# Altium schematic sheet mediaV3.0.SchDoc
size A2; SheetNumber: 0; SheetTotal: 0
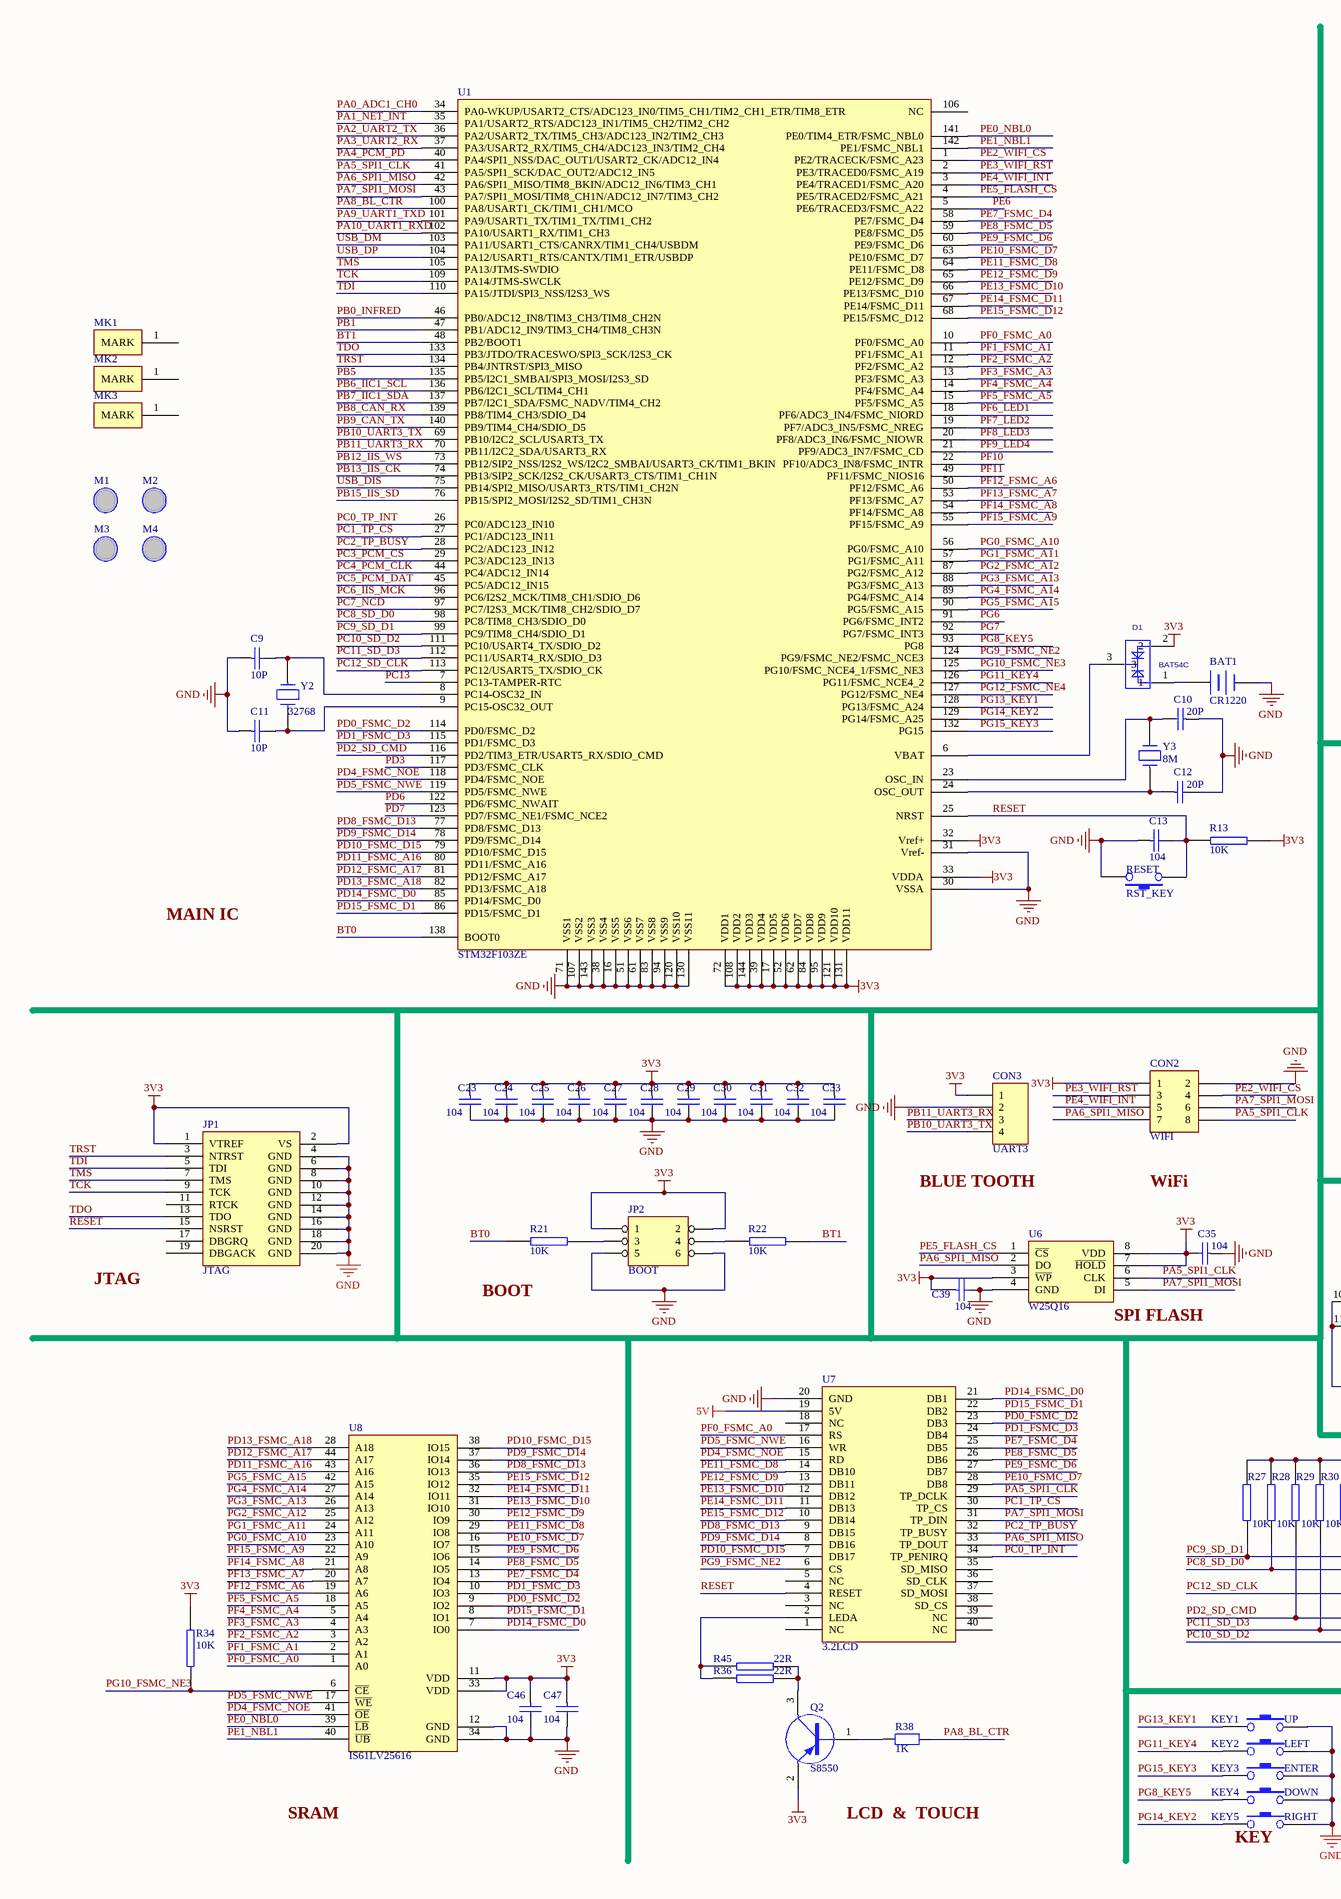
[diagram p0: mediaV3.0.SchDoc, left]
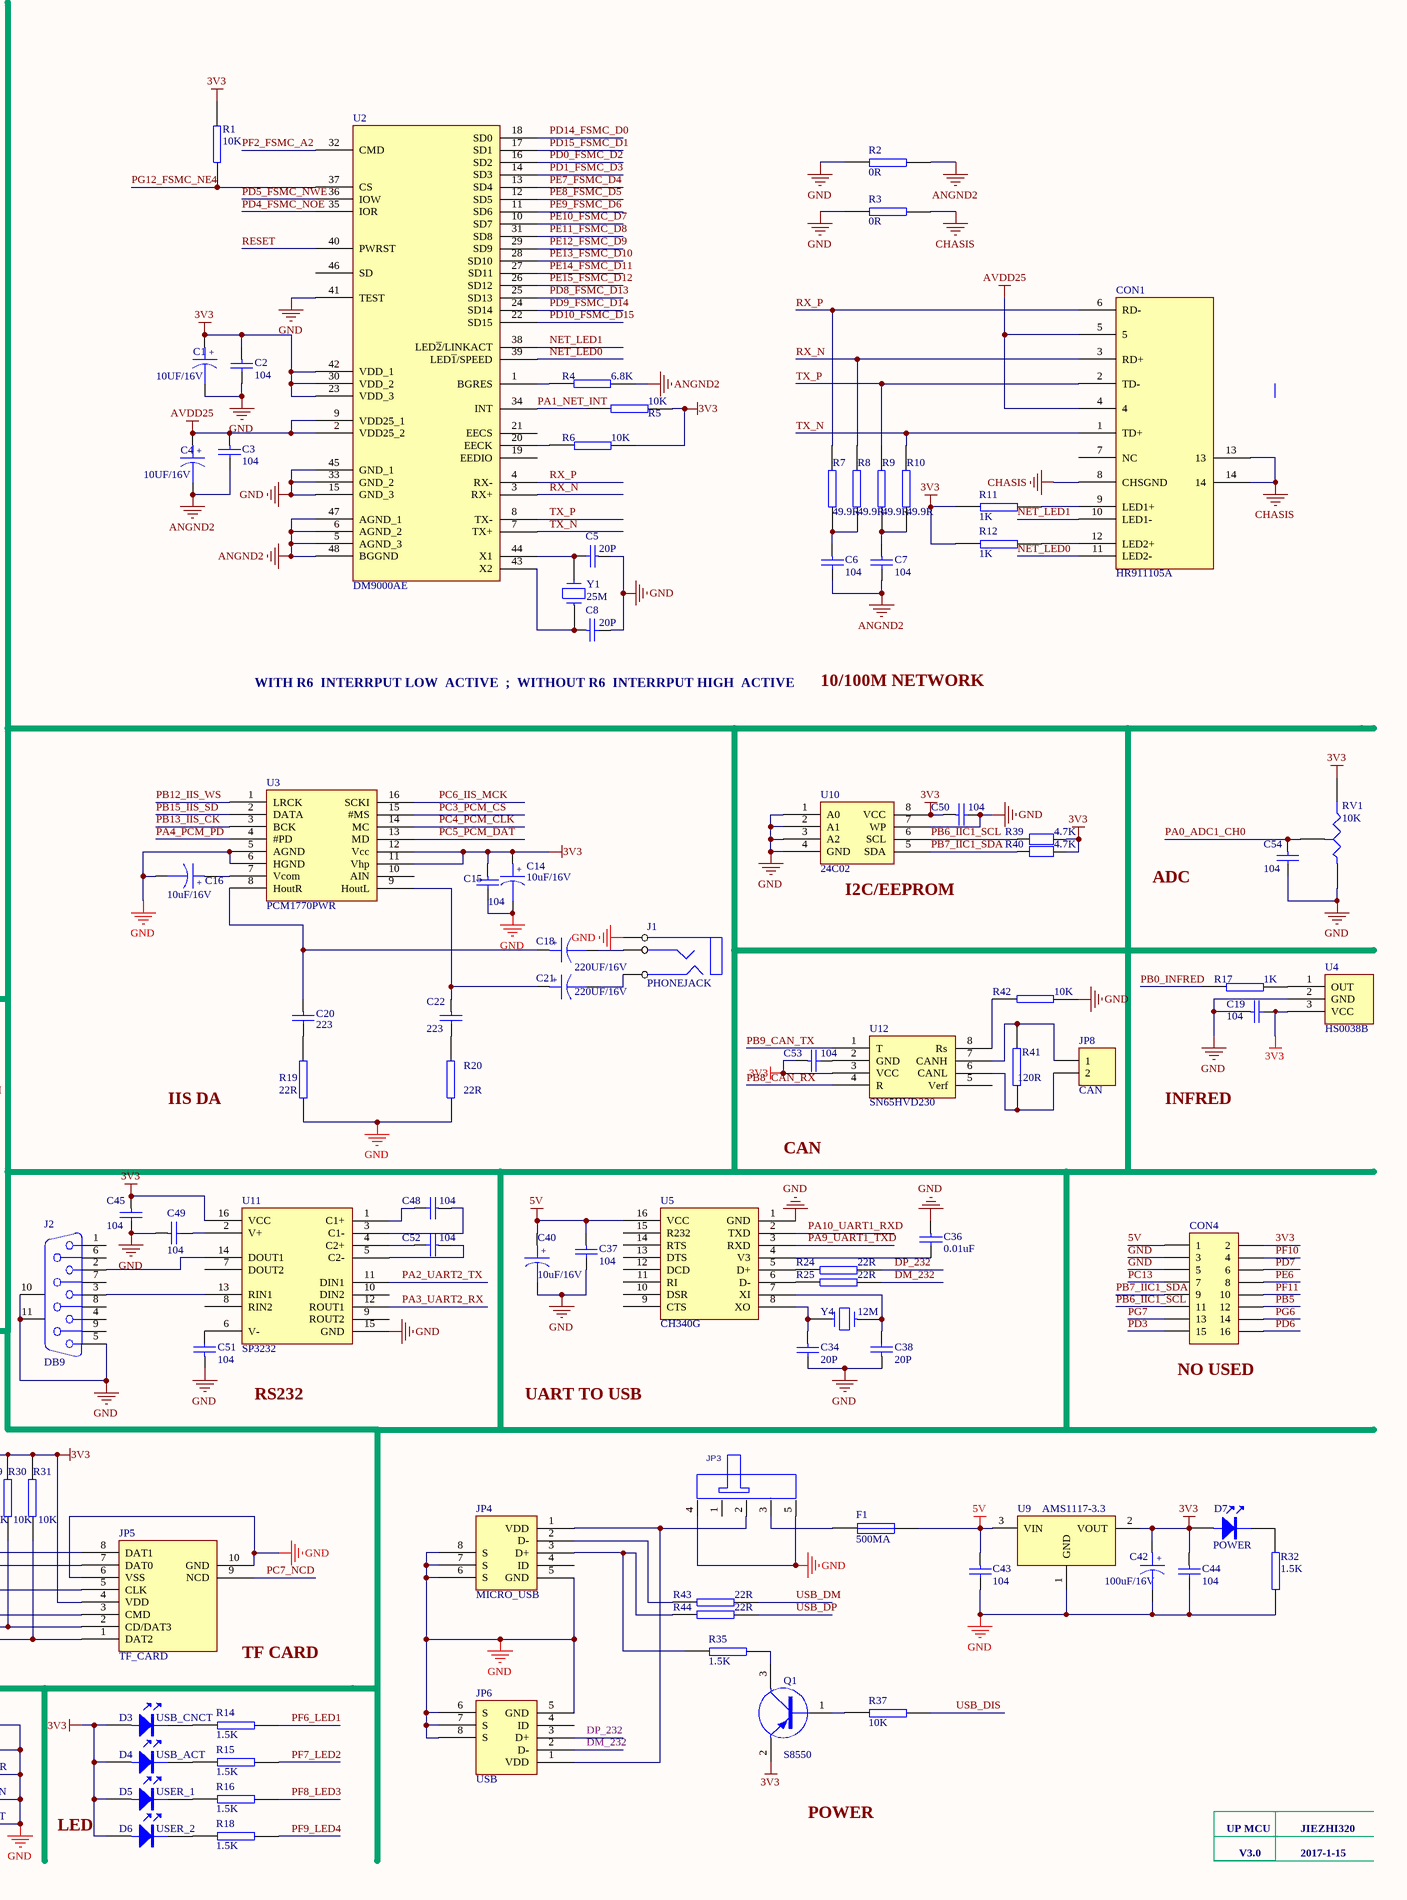
[diagram p1: mediaV3.0.SchDoc, right]

## Parts
BAT1  CR1220  [BATM-1220]
C1  10UF/16V  [0805C]
C2  104  [C0603]
C3  104  [C0603]
C4  10UF/16V  [0805C]
C5  20P  [C0603]
C6  104  [C0603]
C7  104  [C0603]
C8  20P  [C0603]
C9  10P  [C0603]
C10  20P  [C0603]
C11  10P  [C0603]
C12  20P  [C0603]
C13  104  [C0603]
C14  10uF/16V  [0805C]
C15  104  [C0603]
C16  10uF/16V  [0805C]
C18  220UF/16V  [SMD-EC-F6.3]
C19  104  [C0603]
C20  223  [C0603]
C21  220UF/16V  [SMD-EC-F6.3]
C22  223  [C0603]
C23  104  [C0603]
C24  104  [C0603]
C25  104  [C0603]
C26  104  [C0603]
C27  104  [C0603]
C28  104  [C0603]
C29  104  [C0603]
C30  104  [C0603]
C31  104  [C0603]
C32  104  [C0603]
C33  104  [C0603]
C34  20P  [C0603]
C35  104  [C0603]
C36  0.01uF  [C0603]
C37  104  [C0603]
C38  20P  [C0603]
C39  104  [C0603]
C40  10uF/16V  [0805C]
C42  100uF/16V  [SMD-EC-F6.3]
C43  104  [C0603]
C44  104  [C0603]
C45  104  [C0603]
C46  104  [C0603]
C47  104  [C0603]
C48  104  [C0603]
C49  104  [C0603]
C50  104  [C0603]
C51  104  [C0603]
C52  104  [C0603]
C53  104  [C0603]
C54  104  [C0603]
CON1  HR911105A  [CON-HR911105C/RJ45/SC-JL]
CON2  WIFI  [WIFI2*4-2.54]
CON3  UART3  [DIP4*1-2.54]
CON4  (no value)  [DIP8*2-2.54]
D1  BAT54C  [SOT-23]
D3  USB_CNCT  [D0603]
D4  USB_ACT  [D0603]
D5  USER_1  [D0603]
D6  USER_2  [D0603]
D7  POWER  [D0603]
F1  500MA  [R0805]
J1  PHONEJACK  [PHONE_ST]
J2  DB9  [DB-9/FM]
JP1  JTAG  [JTAG_20]
JP2  BOOT  [BOOT_SEL]
JP3  SW-POWER  [SW13_6]  (value not drawn)
JP4  MICRO_USB  [USB-MICRO-5P-2 - NJ]
JP5  TF_CARD  [TF-2]
JP6  USB  [USB-MICRO-5P-2 - NJ]
JP8  CAN  [CON_2PIN - N]
KEY1  UP  [KEY4 - SMD]
KEY2  LEFT  [KEY4 - SMD]
KEY3  ENTER  [KEY4 - SMD]
KEY4  DOWN  [KEY4 - SMD]
KEY5  RIGHT  [KEY4 - SMD]
M1  MM  [PAD]  (value not drawn)
M2  MM  [PAD]  (value not drawn)
M3  MM  [PAD]  (value not drawn)
M4  MM  [PAD]  (value not drawn)
MK1  (no value)  [MARK]
MK2  (no value)  [MARK]
MK3  (no value)  [MARK]
Q1  S8550  [SOT-23]
Q2  S8550  [SOT-23]
R1  10K  [R0603]
R2  0R  [R0603]
R3  0R  [R0603]
R4  6.8K  [R0603]
R5  10K  [R0603]
R6  10K  [R0603]
R7  49.9R  [R0603]
R8  49.9R  [R0603]
R9  49.9R  [R0603]
R10  49.9R  [R0603]
R11  1K  [R0603]
R12  1K  [R0603]
R13  10K  [R0603]
R14  1.5K  [R0603]
R15  1.5K  [R0603]
R16  1.5K  [R0603]
R17  1K  [R0603]
R18  1.5K  [R0603]
R19  22R  [R0603]
R20  22R  [R0603]
R21  10K  [R0603]
R22  10K  [R0603]
R24  22R  [R0603]
R25  22R  [R0603]
R27  10K  [R0603]
R28  10K  [R0603]
R29  10K  [R0603]
R30  10K  [R0603]
R31  10K  [R0603]
R32  1.5K  [R0603]
R34  10K  [R0603]
R35  1.5K  [R0603]
R36  22R  [R0603]
R37  10K  [R0603]
R38  1K  [R0603]
R39  4.7K  [R0603]
R40  4.7K  [R0603]
R41  120R  [R0603]
R42  10K  [R0603]
R43  22R  [R0603]
R44  22R  [R0603]
R45  22R  [R0603]
RESET  RST_KEY  [KEY4 - SMD]
RV1  10K  [VR5 - N]
U1  STM32F103ZE  [LQFP144-M]
U2  DM9000AE  [QFP48]
U3  PCM1770PWR  [TSSOP-16]
U4  HS0038B  [HS0038]
U5  CH340G  [SOP16M]
U6  W25Q16  [SOP8]
U7  3.2LCD  [LCD]
U8  IS61LV25616  [TSOP44-2]
U9  AMS1117-3.3  [SOT-223/P2.3]
U10  24C02  [SOP-8]
U11  SP3232  [SOP16M]
U12  SN65HVD230  [SOP-8]
Y1  25M  [XTAL2]
Y2  32768  [XT-32768T]
Y3  8M  [XTAL2]
Y4  12M  [XTAL2]

## Nets
3V3: C1.1 C2.1 C14.1 C15.1 C19.2 C23.1 C24.1 C25.1 C26.1 C27.1 C28.1 C29.1 C30.1 C31.1 C32.1 C33.1 C35.2 C39.1 C42.1 C44.1 C45.1 C46.1 C47.1 C50.1 C53.1 CON2.1 CON3.1 CON4.2 D1.2 D3.1 D4.1 D5.1 D6.1 D7.1 JP1.1(VTREF) JP1.2(VS) JP2.1 JP2.2 JP5.4(VDD) Q1.2(E) Q2.2(E) R1.2 R5.2 R6.2 R11.1 R12.1 R13.2 R27.2 R28.2 R29.2 R30.2 R31.2 R34.2 R39.2 R40.2 RV1.2(B) U1.17(VDD5) U1.32(Vref+) U1.33(VDDA) U1.39(VDD4) U1.52(VDD6) U1.62(VDD7) U1.72(VDD1) U1.84(VDD8) U1.95(VDD9) U1.108(VDD2) U1.121(VDD10) U1.131(VDD11) U1.144(VDD3) U2.23(VDD_3) U2.30(VDD_2) U2.42(VDD_1) U3.11(Vhp) U3.12(Vcc) U4.3(VCC) U6.3(~{W}~{P}) U6.7(~{H}~{O}~{L}~{D}) U6.8(VDD) U8.11(VDD) U8.33(VDD) U9.2(VOUT) U10.8(VCC) U11.16(VCC) U12.3(VCC)
5V: C37.1 C40.1 C43.1 CON4.1 F1.2 U5.16(VCC) U7.19(5V) U9.3(VIN)
ANGND2: C3.2 C4.2 C6.2 C7.2 R2.2 R4.1 U2.5(AGND_3) U2.6(AGND_2) U2.47(AGND_1) U2.48(BGGND)
AVDD25: C3.1 C4.1 CON1.4 CON1.5 U2.2(VDD25_2) U2.9(VDD25_1)
CHASIS: CON1.8(CHSGND) CON1.13 CON1.14 R3.2
GND: BAT1.2(-) C1.2 C2.2 C5.1 C8.2 C9.1 C10.1 C11.1 C12.2 C13.1 C14.2 C15.2 C16.2 C19.1 C23.2 C24.2 C25.2 C26.2 C27.2 C28.2 C29.2 C30.2 C31.2 C32.2 C33.2 C34.2 C35.1 C36.1 C37.2 C38.1 C39.2 C40.2 C42.2 C43.2 C44.2 C45.2 C46.2 C47.2 C49.1 C50.2 C51.1 C54.2 CON2.2 CON3.2 CON4.3 CON4.5 J1.3(C) J2.5 J2.10(MH1) J2.11(MH2) JP1.4(GND) JP1.6(GND) JP1.8(GND) JP1.10(GND) JP1.12(GND) JP1.14(GND) JP1.16(GND) JP1.18(GND) JP1.20(GND) JP2.5 JP2.6 JP3.4 JP3.5 JP4.5(GND) JP4.6(S) JP4.7(S) JP4.8(S) JP5.6(VSS) JP5.10(GND) JP6.5(GND) JP6.6(S) JP6.7(S) JP6.8(S) KEY1.1 KEY2.1 KEY3.1 KEY4.1 KEY5.1 R2.1 R3.1 R19.1 R20.1 R32.2 R42.1 RESET.1 RV1.1(A) U1.16(VSS5) U1.30(VSSA) U1.31(Vref-) U1.38(VSS4) U1.51(VSS6) U1.61(VSS7) U1.71(VSS1) U1.83(VSS8) U1.94(VSS9) U1.107(VSS2) U1.120(VSS10) U1.130(VSS11) U1.143(VSS3) U2.15(GND_3) U2.33(GND_2) U2.41(TEST) U2.45(GND_1) U3.5(AGND) U3.6(HGND) U4.2(GND) U5.1(GND) U6.4(GND) U7.20(GND) U8.12(GND) U8.34(GND) U9.1(GND) U10.1(A0) U10.2(A1) U10.3(A2) U10.4(GND) U10.7(WP) U11.15(GND)
BT0: R21.1 U1.138(BOOT0)
BT1: R22.2 U1.48(PB2/BOOT1)
DM_232: JP6.2(D-) R25.2
DP_232: JP6.3(D+) R24.2
NET_LED0: CON1.11(LED2-) U2.39(LED~{1}/SPEED)
NET_LED1: CON1.10(LED1-) U2.38(LED~{2}/LINKACT)
PA0_ADC1_CH0: C54.1 RV1.3(TAP) U1.34(PA0-WKUP/USART2_CTS/ADC123_IN0/TIM5_CH1/TIM2_CH1_ETR/TIM8_ETR)
PA1_NET_INT: R5.1 U1.35(PA1/USART2_RTS/ADC123_IN1/TIM5_CH2/TIM2_CH2) U2.34(INT)
PA2_UART2_TX: U1.36(PA2/USART2_TX/TIM5_CH3/ADC123_IN2/TIM2_CH3) U11.11(DIN1)
PA3_UART2_RX: U1.37(PA3/USART2_RX/TIM5_CH4/ADC123_IN3/TIM2_CH4) U11.12(ROUT1)
PA4_PCM_PD: U1.40(PA4/SPI1_NSS/DAC_OUT1/USART2_CK/ADC12_IN4) U3.4(#PD)
PA5_SPI1_CLK: CON2.8 U1.41(PA5/SPI1_SCK/DAC_OUT2/ADC12_IN5) U6.6(CLK) U7.29(TP_DCLK)
PA6_SPI1_MISO: CON2.7 U1.42(PA6/SPI1_MISO/TIM8_BKIN/ADC12_IN6/TIM3_CH1) U6.2(DO) U7.33(TP_DOUT)
PA7_SPI1_MOSI: CON2.6 U1.43(PA7/SPI1_MOSI/TIM8_CH1N/ADC12_IN7/TIM3_CH2) U6.5(DI) U7.31(TP_DIN)
PA8_BL_CTR: R38.2 U1.100(PA8/USART1_CK/TIM1_CH1/MCO)
PA9_UART1_TXD: U1.101(PA9/USART1_TX/TIM1_TX/TIM1_CH2) U5.3(RXD)
PA10_UART1_RXD: U1.102(PA10/USART1_RX/TIM1_CH3) U5.2(TXD)
PB0_INFRED: R17.1 U1.46(PB0/ADC12_IN8/TIM3_CH3/TIM8_CH2N)
PB1: U1.47(PB1/ADC12_IN9/TIM3_CH4/TIM8_CH3N)
PB5: CON4.12 U1.135(PB5/I2C1_SMBAI/SPI3_MOSI/I2S3_SD)
PB6_IIC1_SCL: CON4.11 R39.1 U1.136(PB6/I2C1_SCL/TIM4_CH1) U10.6(SCL)
PB7_IIC1_SDA: CON4.9 R40.1 U1.137(PB7/I2C1_SDA/FSMC_NADV/TIM4_CH2) U10.5(SDA)
PB8_CAN_RX: U1.139(PB8/TIM4_CH3/SDIO_D4) U12.4(R)
PB9_CAN_TX: U1.140(PB9/TIM4_CH4/SDIO_D5) U12.1(T)
PB10_UART3_TX: CON3.4 U1.69(PB10/I2C2_SCL/USART3_TX)
PB11_UART3_RX: CON3.3 U1.70(PB11/I2C2_SDA/USART3_RX)
PB12_IIS_WS: U1.73(PB12/SIP2_NSS/I2S2_WS/I2C2_SMBAI/USART3_CK/TIM1_BKIN) U3.1(LRCK)
PB13_IIS_CK: U1.74(PB13/SIP2_SCK/I2S2_CK/USART3_CTS/TIM1_CH1N) U3.3(BCK)
PB15_IIS_SD: U1.76(PB15/SPI2_MOSI/I2S2_SD/TIM1_CH3N) U3.2(DATA)
PC0_TP_INT: U1.26(PC0/ADC123_IN10) U7.34(TP_PENIRQ)
PC1_TP_CS: U1.27(PC1/ADC123_IN11) U7.30(TP_CS)
PC2_TP_BUSY: U1.28(PC2/ADC123_IN12) U7.32(TP_BUSY)
PC3_PCM_CS: U1.29(PC3/ADC123_IN13) U3.15(#MS)
PC4_PCM_CLK: U1.44(PC4/ADC12_IN14) U3.14(MC)
PC5_PCM_DAT: U1.45(PC5/ADC12_IN15) U3.13(MD)
PC6_IIS_MCK: U1.96(PC6/I2S2_MCK/TIM8_CH1/SDIO_D6) U3.16(SCKI)
PC7_NCD: JP5.9(NCD) U1.97(PC7/I2S3_MCK/TIM8_CH2/SDIO_D7)
PC8_SD_D0: JP5.7(DAT0) R28.1 U1.98(PC8/TIM8_CH3/SDIO_D0)
PC9_SD_D1: JP5.8(DAT1) R27.1 U1.99(PC9/TIM8_CH4/SDIO_D1)
PC10_SD_D2: JP5.1(DAT2) R31.1 U1.111(PC10/USART4_TX/SDIO_D2)
PC11_SD_D3: JP5.2(CD/DAT3) R30.1 U1.112(PC11/USART4_RX/SDIO_D3)
PC12_SD_CLK: JP5.5(CLK) U1.113(PC12/USART5_TX/SDIO_CK)
PC13: CON4.7 U1.7(PC13-TAMPER-RTC)
PD0_FSMC_D2: U1.114(PD0/FSMC_D2) U2.16(SD2) U7.23(DB3) U8.9(IO2)
PD1_FSMC_D3: U1.115(PD1/FSMC_D3) U2.14(SD3) U7.24(DB4) U8.10(IO3)
PD2_SD_CMD: JP5.3(CMD) R29.1 U1.116(PD2/TIM3_ETR/USART5_RX/SDIO_CMD)
PD3: CON4.15 U1.117(PD3/FSMC_CLK)
PD4_FSMC_NOE: U1.118(PD4/FSMC_NOE) U2.35(IOR) U7.15(RD) U8.41(~{OE})
PD5_FSMC_NWE: U1.119(PD5/FSMC_NWE) U2.36(IOW) U7.16(WR) U8.17(~{WE})
PD6: CON4.16 U1.122(PD6/FSMC_NWAIT)
PD7: CON4.6 U1.123(PD7/FSMC_NE1/FSMC_NCE2)
PD8_FSMC_D13: U1.77(PD8/FSMC_D13) U2.25(SD13) U7.9(DB15) U8.36(IO13)
PD9_FSMC_D14: U1.78(PD9/FSMC_D14) U2.24(SD14) U7.8(DB16) U8.37(IO14)
PD10_FSMC_D15: U1.79(PD10/FSMC_D15) U2.22(SD15) U7.7(DB17) U8.38(IO15)
PD11_FSMC_A16: U1.80(PD11/FSMC_A16) U8.43(A16)
PD12_FSMC_A17: U1.81(PD12/FSMC_A17) U8.44(A17)
PD13_FSMC_A18: U1.82(PD13/FSMC_A18) U8.28(A18)
PD14_FSMC_D0: U1.85(PD14/FSMC_D0) U2.18(SD0) U7.21(DB1) U8.7(IO0)
PD15_FSMC_D1: U1.86(PD15/FSMC_D1) U2.17(SD1) U7.22(DB2) U8.8(IO1)
PE0_NBL0: U1.141(PE0/TIM4_ETR/FSMC_NBL0) U8.39(~{LB})
PE1_NBL1: U1.142(PE1/FSMC_NBL1) U8.40(~{UB})
PE2_WIFI_CS: CON2.4 U1.1(PE2/TRACECK/FSMC_A23)
PE3_WIFI_RST: CON2.3 U1.2(PE3/TRACED0/FSMC_A19)
PE4_WIFI_INT: CON2.5 U1.3(PE4/TRACED1/FSMC_A20)
PE5_FLASH_CS: U1.4(PE5/TRACED2/FSMC_A21) U6.1(~{C}~{S})
PE6: CON4.8 U1.5(PE6/TRACED3/FSMC_A22)
PE7_FSMC_D4: U1.58(PE7/FSMC_D4) U2.13(SD4) U7.25(DB5) U8.13(IO4)
PE8_FSMC_D5: U1.59(PE8/FSMC_D5) U2.12(SD5) U7.26(DB6) U8.14(IO5)
PE9_FSMC_D6: U1.60(PE9/FSMC_D6) U2.11(SD6) U7.27(DB7) U8.15(IO6)
PE10_FSMC_D7: U1.63(PE10/FSMC_D7) U2.10(SD7) U7.28(DB8) U8.16(IO7)
PE11_FSMC_D8: U1.64(PE11/FSMC_D8) U2.31(SD8) U7.14(DB10) U8.29(IO8)
PE12_FSMC_D9: U1.65(PE12/FSMC_D9) U2.29(SD9) U7.13(DB11) U8.30(IO9)
PE13_FSMC_D10: U1.66(PE13/FSMC_D10) U2.28(SD10) U7.12(DB12) U8.31(IO10)
PE14_FSMC_D11: U1.67(PE14/FSMC_D11) U2.27(SD11) U7.11(DB13) U8.32(IO11)
PE15_FSMC_D12: U1.68(PE15/FSMC_D12) U2.26(SD12) U7.10(DB14) U8.35(IO12)
PF0_FSMC_A0: U1.10(PF0/FSMC_A0) U7.17(RS) U8.1(A0)
PF1_FSMC_A1: U1.11(PF1/FSMC_A1) U8.2(A1)
PF2_FSMC_A2: U1.12(PF2/FSMC_A2) U2.32(CMD) U8.3(A2)
PF3_FSMC_A3: U1.13(PF3/FSMC_A3) U8.4(A3)
PF4_FSMC_A4: U1.14(PF4/FSMC_A4) U8.5(A4)
PF5_FSMC_A5: U1.15(PF5/FSMC_A5) U8.18(A5)
PF6_LED1: R14.2 U1.18(PF6/ADC3_IN4/FSMC_NIORD)
PF7_LED2: R15.2 U1.19(PF7/ADC3_IN5/FSMC_NREG)
PF8_LED3: R16.2 U1.20(PF8/ADC3_IN6/FSMC_NIOWR)
PF9_LED4: R18.2 U1.21(PF9/ADC3_IN7/FSMC_CD)
PF10: CON4.4 U1.22(PF10/ADC3_IN8/FSMC_INTR)
PF11: CON4.10 U1.49(PF11/FSMC_NIOS16)
PF12_FSMC_A6: U1.50(PF12/FSMC_A6) U8.19(A6)
PF13_FSMC_A7: U1.53(PF13/FSMC_A7) U8.20(A7)
PF14_FSMC_A8: U1.54(PF14/FSMC_A8) U8.21(A8)
PF15_FSMC_A9: U1.55(PF15/FSMC_A9) U8.22(A9)
PG0_FSMC_A10: U1.56(PG0/FSMC_A10) U8.23(A10)
PG1_FSMC_A11: U1.57(PG1/FSMC_A11) U8.24(A11)
PG2_FSMC_A12: U1.87(PG2/FSMC_A12) U8.25(A12)
PG3_FSMC_A13: U1.88(PG3/FSMC_A13) U8.26(A13)
PG4_FSMC_A14: U1.89(PG4/FSMC_A14) U8.27(A14)
PG5_FSMC_A15: U1.90(PG5/FSMC_A15) U8.42(A15)
PG6: CON4.14 U1.91(PG6/FSMC_INT2)
PG7: CON4.13 U1.92(PG7/FSMC_INT3)
PG8_KEY5: KEY4.2 U1.93(PG8)
PG9_FSMC_NE2: U1.124(PG9/FSMC_NE2/FSMC_NCE3) U7.6(CS)
PG10_FSMC_NE3: R34.1 U1.125(PG10/FSMC_NCE4_1/FSMC_NE3) U8.6(~{CE})
PG11_KEY4: KEY2.2 U1.126(PG11/FSMC_NCE4_2)
PG12_FSMC_NE4: R1.1 U1.127(PG12/FSMC_NE4) U2.37(CS)
PG13_KEY1: KEY1.2 U1.128(PG13/FSMC_A24)
PG14_KEY2: KEY5.2 U1.129(PG14/FSMC_A25)
PG15_KEY3: KEY3.2 U1.132(PG15)
RESET: C13.2 JP1.15(NSRST) R13.1 RESET.2 U1.25(NRST) U2.40(PWRST) U7.4(RESET)
RX_N: CON1.3(RD+) R8.2 U2.3(RX+)
RX_P: CON1.6(RD-) R7.2 U2.4(RX-)
TCK: JP1.9(TCK) U1.109(PA14/JTMS-SWCLK)
TDI: JP1.5(TDI) U1.110(PA15/JTDI/SPI3_NSS/I2S3_WS)
TDO: JP1.13(TDO) U1.133(PB3/JTDO/TRACESWO/SPI3_SCK/I2S3_CK)
TMS: JP1.7(TMS) U1.105(PA13/JTMS-SWDIO)
TRST: JP1.3(NTRST) U1.134(PB4/JNTRST/SPI3_MISO)
TX_N: CON1.1(TD+) R10.2 U2.7(TX+)
TX_P: CON1.2(TD-) R9.2 U2.8(TX-)
USB_DIS: R37.2 U1.75(PB14/SPI2_MISO/USART3_RTS/TIM1_CH2N)
USB_DM: R43.2 U1.103(PA11/USART1_CTS/CANRX/TIM1_CH4/USBDM)
USB_DP: R44.2 U1.104(PA12/USART1_RTS/CANTX/TIM1_ETR/USBDP)
NetBAT1_1: BAT1.1(+) D1.1
NetC5_2: C5.2 U2.44(X1) Y1.2
NetC6_1: C6.1 R7.1 R8.1
NetC7_1: C7.1 R9.1 R10.1
NetC8_1: C8.1 U2.43(X2) Y1.1
NetC9_2: C9.2 U1.8(PC14-OSC32_IN) Y2.1
NetC10_2: C10.2 U1.23(OSC_IN) Y3.2
NetC11_2: C11.2 U1.9(PC15-OSC32_OUT) Y2.2
NetC12_1: C12.1 U1.24(OSC_OUT) Y3.1
NetC16_1: C16.1 U3.7(Vcom)
NetC18_1: C18.1 C20.1 U3.8(HoutR)
NetC18_2: C18.2 J1.2(B)
NetC20_2: C20.2 R19.2
NetC21_1: C21.1 C22.1 U3.9(HoutL)
NetC21_2: C21.2 J1.1(A)
NetC22_2: C22.2 R20.2
NetC34_1: C34.1 U5.8(XO) Y4.2
NetC36_2: C36.2 U5.4(V3)
NetC38_2: C38.2 U5.7(XI) Y4.1
NetC48_1: C48.1 U11.3(C1-)
NetC48_2: C48.2 U11.1(C1+)
NetC49_2: C49.2 U11.2(V+)
NetC51_2: C51.2 U11.6(V-)
NetC52_1: C52.1 U11.5(C2-)
NetC52_2: C52.2 U11.4(C2+)
NetC53_2: C53.2 U12.2(GND)
NetCON1_9: CON1.9(LED1+) R11.2
NetCON1_12: CON1.12(LED2+) R12.2
NetD1_3: D1.3 U1.6(VBAT)
NetD3_2: D3.2 R14.1
NetD4_2: D4.2 R15.1
NetD5_2: D5.2 R16.1
NetD6_2: D6.2 R18.1
NetD7_2: D7.2 R32.1
NetF1_1: F1.1 JP3.3
NetJ2_2: J2.2 U11.14(DOUT1)
NetJ2_3: J2.3 U11.13(RIN1)
NetJP2_3: JP2.3 R21.2
NetJP2_4: JP2.4 R22.1
NetJP3_2: JP3.2 JP4.1(VDD) JP6.1(VDD)
NetJP4_2: JP4.2(D-) R43.1
NetJP4_3: JP4.3(D+) R35.1 R44.1
NetJP8_1: JP8.1 R41.2 U12.7(CANH)
NetJP8_2: JP8.2 R41.1 U12.6(CANL)
NetQ1_1: Q1.1(B) R37.1
NetQ1_3: Q1.3(C) R35.2
NetQ2_1: Q2.1(B) R38.1
NetQ2_3: Q2.3(C) R36.2 R45.2
NetR4_2: R4.2 U2.1(BGRES)
NetR6_1: R6.1 U2.20(EECK)
NetR17_2: R17.2 U4.1(OUT)
NetR24_1: R24.1 U5.5(D+)
NetR25_1: R25.1 U5.6(D-)
NetR36_1: R36.1 R45.1 U7.2(LEDA)
NetR42_2: R42.2 U12.8(Rs)

Not connected (* = marked no-connect by the designer): CON1 7(NC); J2 1 4 6 7 8 9; JP1 11(RTCK) 17(DBGRQ) 19(DBGACK); JP3 1; JP4 4(ID); JP6 4(ID); MK1 1(MARK); MK2 1(MARK); MK3 1(MARK); U1 106(NC); U2 19(EEDIO) 21(EECS) 46(SD); U3 10(AIN); U5 9(CTS) 10(DSR) 11(RI) 12(DCD) 13(DTS) 14(RTS) 15(R232); U7 1(NC) 3(NC) 5(NC) 18(NC) 35(SD_MISO) 36(SD_CLK) 37(SD_MOSI) 38(SD_CS) 39(NC) 40(NC); U11 7(DOUT2) 8(RIN2) 9(ROUT2) 10(DIN2); U12 5(Verf)

## Notes on the sheet
- WITH R6  INTERRPUT LOW  ACTIVE  ;  WITHOUT R6  INTERRPUT HIGH  ACTIVE
- 10/100M NETWORK
- MAIN IC
- (near U10) I2C/EEPROM
- ADC
- IIS DA
- INFRED
- BLUE TOOTH
- WiFi
- CAN
- JTAG
- (near R21) BOOT
- (near U6) SPI FLASH
- RS232
- UART TO USB
- (near CON4) NO USED
- (near JP5) TF CARD
- SRAM
- LCD  &  TOUCH
- (near KEY5) KEY
- LED
- POWER
- UP MCU
- V3.0
- JIEZHI320
- 2017-1-15
- (in symbol CAPACITOR POL) +

## Library data of the parts
BAT1 = BATTERY
C1 C4 C14 C16 C18 C21 C40 C42 = CAPACITOR POL: Capacitor
C2 C3 C5-C13 C15 C19 C20 C22-C39 C43-C54 = CAP: Capacitor
CON1 = CN-NET_T/RJ45/HR911105A/HIDE
CON2 = Header 4X2: Header, 4-Pin, Dual row; LatestRevisionDate: 17-Jul-2002; LatestRevisionNote: Re-released for DXP Platform.; Publisher: Altium Limited
CON3 = MHDR1X4: Header, 4-Pin; LatestRevisionDate: 17-Jul-2002; LatestRevisionNote: Re-released for DXP Platform.; Publisher: Altium Limited
CON4 = Header 8X2: Header, 8-Pin, Dual row; LatestRevisionDate: 17-Jul-2002; LatestRevisionNote: Re-released for DXP Platform.; Publisher: Altium Limited
D3 D7 = LED: POW
D4-D6 = LED
F1 = Fuse 1: Fuse; Published: 8-Jun-2000; LatestRevisionDate: 17-Jul-2002; LatestRevisionNote: Re-released for DXP Platform.; PackageReference: PIN-W2/E2.8; Publisher: Altium Limited
J1 = PHONEJACK STEREO
J2 = D: Receptacle Assembly, 9 Position, Right Angle; PackageDocument: O; Positions: 9; Published: 15-Jun-2001; LatestRevisionDate: 17-Jul-2002; LatestRevisionNote: Re-released for DXP Platform.; DatasheetDocument: 1-Sep-1999; PackageReference: 788750; Publisher: Altium Limited; Orientation: Right Angle; Gender: Receptacle
JP2 = HEADER 3X2
JP3 = SW-POWER: SW-5; Manufacturer #1 PN: SW-5; PCB DECAL: SW13_6
JP6 = MICRO_USB
JP8 = Header 2: Header, 2-Pin; LatestRevisionDate: 17-Jul-2002; LatestRevisionNote: Re-released for DXP Platform.; Publisher: Altium Limited
KEY1-KEY5 RESET = SW-PB
MK1-MK3 = MARK
Q1 Q2 = PNP: PNP Transistor
R1-R22 R24 R25 R27-R32 R34-R37 R41-R45 = RES2
R38 = Res2: Resistor; Published: 8-Jun-2000; LatestRevisionDate: 17-Jul-2002; LatestRevisionNote: Re-released for DXP Platform.; PackageReference: AXIAL-0.4; Publisher: Altium Limited; Value: 1K
R39 R40 = Res2: Resistor; Value: 1K; Published: 8-Jun-2000; LatestRevisionDate: 17-Jul-2002; LatestRevisionNote: Re-released for DXP Platform.; PackageReference: AXIAL-0.4; Publisher: Altium Limited
RV1 = RESISTOR TAPPED
U2 = U-DM9000AE/LQFP-48P-Y: VALUE: *; PART NUMBER: *; PART DESC: *; PCB DECAL: *
U3 = PCM1770
U4 = INFRED
U8 = IS61LV51216
U9 = AMS1117
Y1-Y4 = CRYSTAL
D1 = BAT54C: Value: BAT54C; PCB DECAL: SOT-23